# Altium schematic sheet driver_low_side.SchDoc
size A
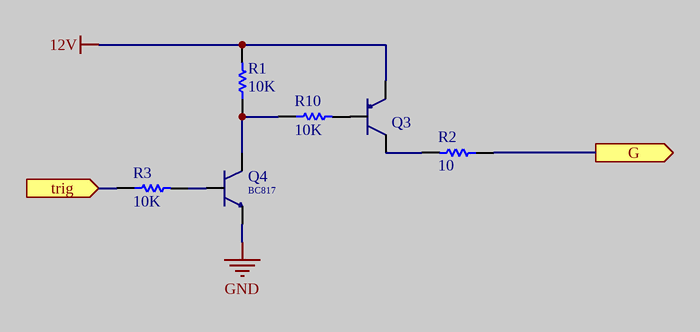
[diagram p0: driver_low_side.SchDoc]

## Parts
Q3  PNP  [NPN]  (value not drawn)
Q4  NPN transistor  [NPN]  (value not drawn)
R1  10K  [RESC0603]
R2  10  [RESC0603]
R3  10K  [RESC0603]
R10  10K  [RESC0603]

## Ports
G (out), trig (in)

## Nets
12V: Q3.2(E) R1.2
GND: Q4.2(E)
G: R2.1 ; port G
trig: R3.1 ; port trig
NetQ3_1: Q3.1(B) R10.2
NetQ3_3: Q3.3(C) R2.2
NetQ4_1: Q4.1(B) R3.2
NetQ4_3: Q4.3(C) R1.1 R10.1

## Library data of the parts
Q3 = BC807: 45 V, 0.5 A
Q4 = BC817: 45 V, 0.5 A; Transistor: BC817
R1-R3 R10 = Resistor: 0603,0.1W; Published: 8-Jun-2000; LatestRevisionDate: 17-Jul-2002; LatestRevisionNote: Re-released for DXP Platform.; PackageReference: AXIAL-0.5; Publisher: Altium Limited
  R1 R3 R10: Value: 10K
  R2: Value: 10